# Altium schematic sheet Cap 10pF 25V.schdoc
size 127 x 101 mm
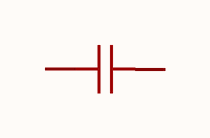
[diagram p0: Cap 10pF 25V.schdoc]

## Parts
C?  10pF  [C0603]  (value not drawn)

## Nets

Not connected (* = marked no-connect by the designer): C? 1 2

## Library data of the parts
C? = CC0603JRNPO8BN100: Manufacturer: YAGEO(国巨); Add into BOM: yes; Tolerance: ±5%; Symbol: CC0603JRNPO8BN100; Device: CC0603JRNPO8BN100; LCSC Part Name: 10pF ±5% 25V; Supplier Part: C1853175; Manufacturer Part: CC0603JRNPO8BN100; Supplier Footprint: 0603; JLCPCB Part Class: Extended Part; Datasheet: https://atta.szlcsc.com/upload/public/pdf/source/20210519/C1853175_08ABFC5682B471E6C773F36F7C78F8CE.pdf; Supplier: LCSC; Convert to PCB: yes; Value: 10pF